# Altium project A540R260_ARM2.PrjPcb
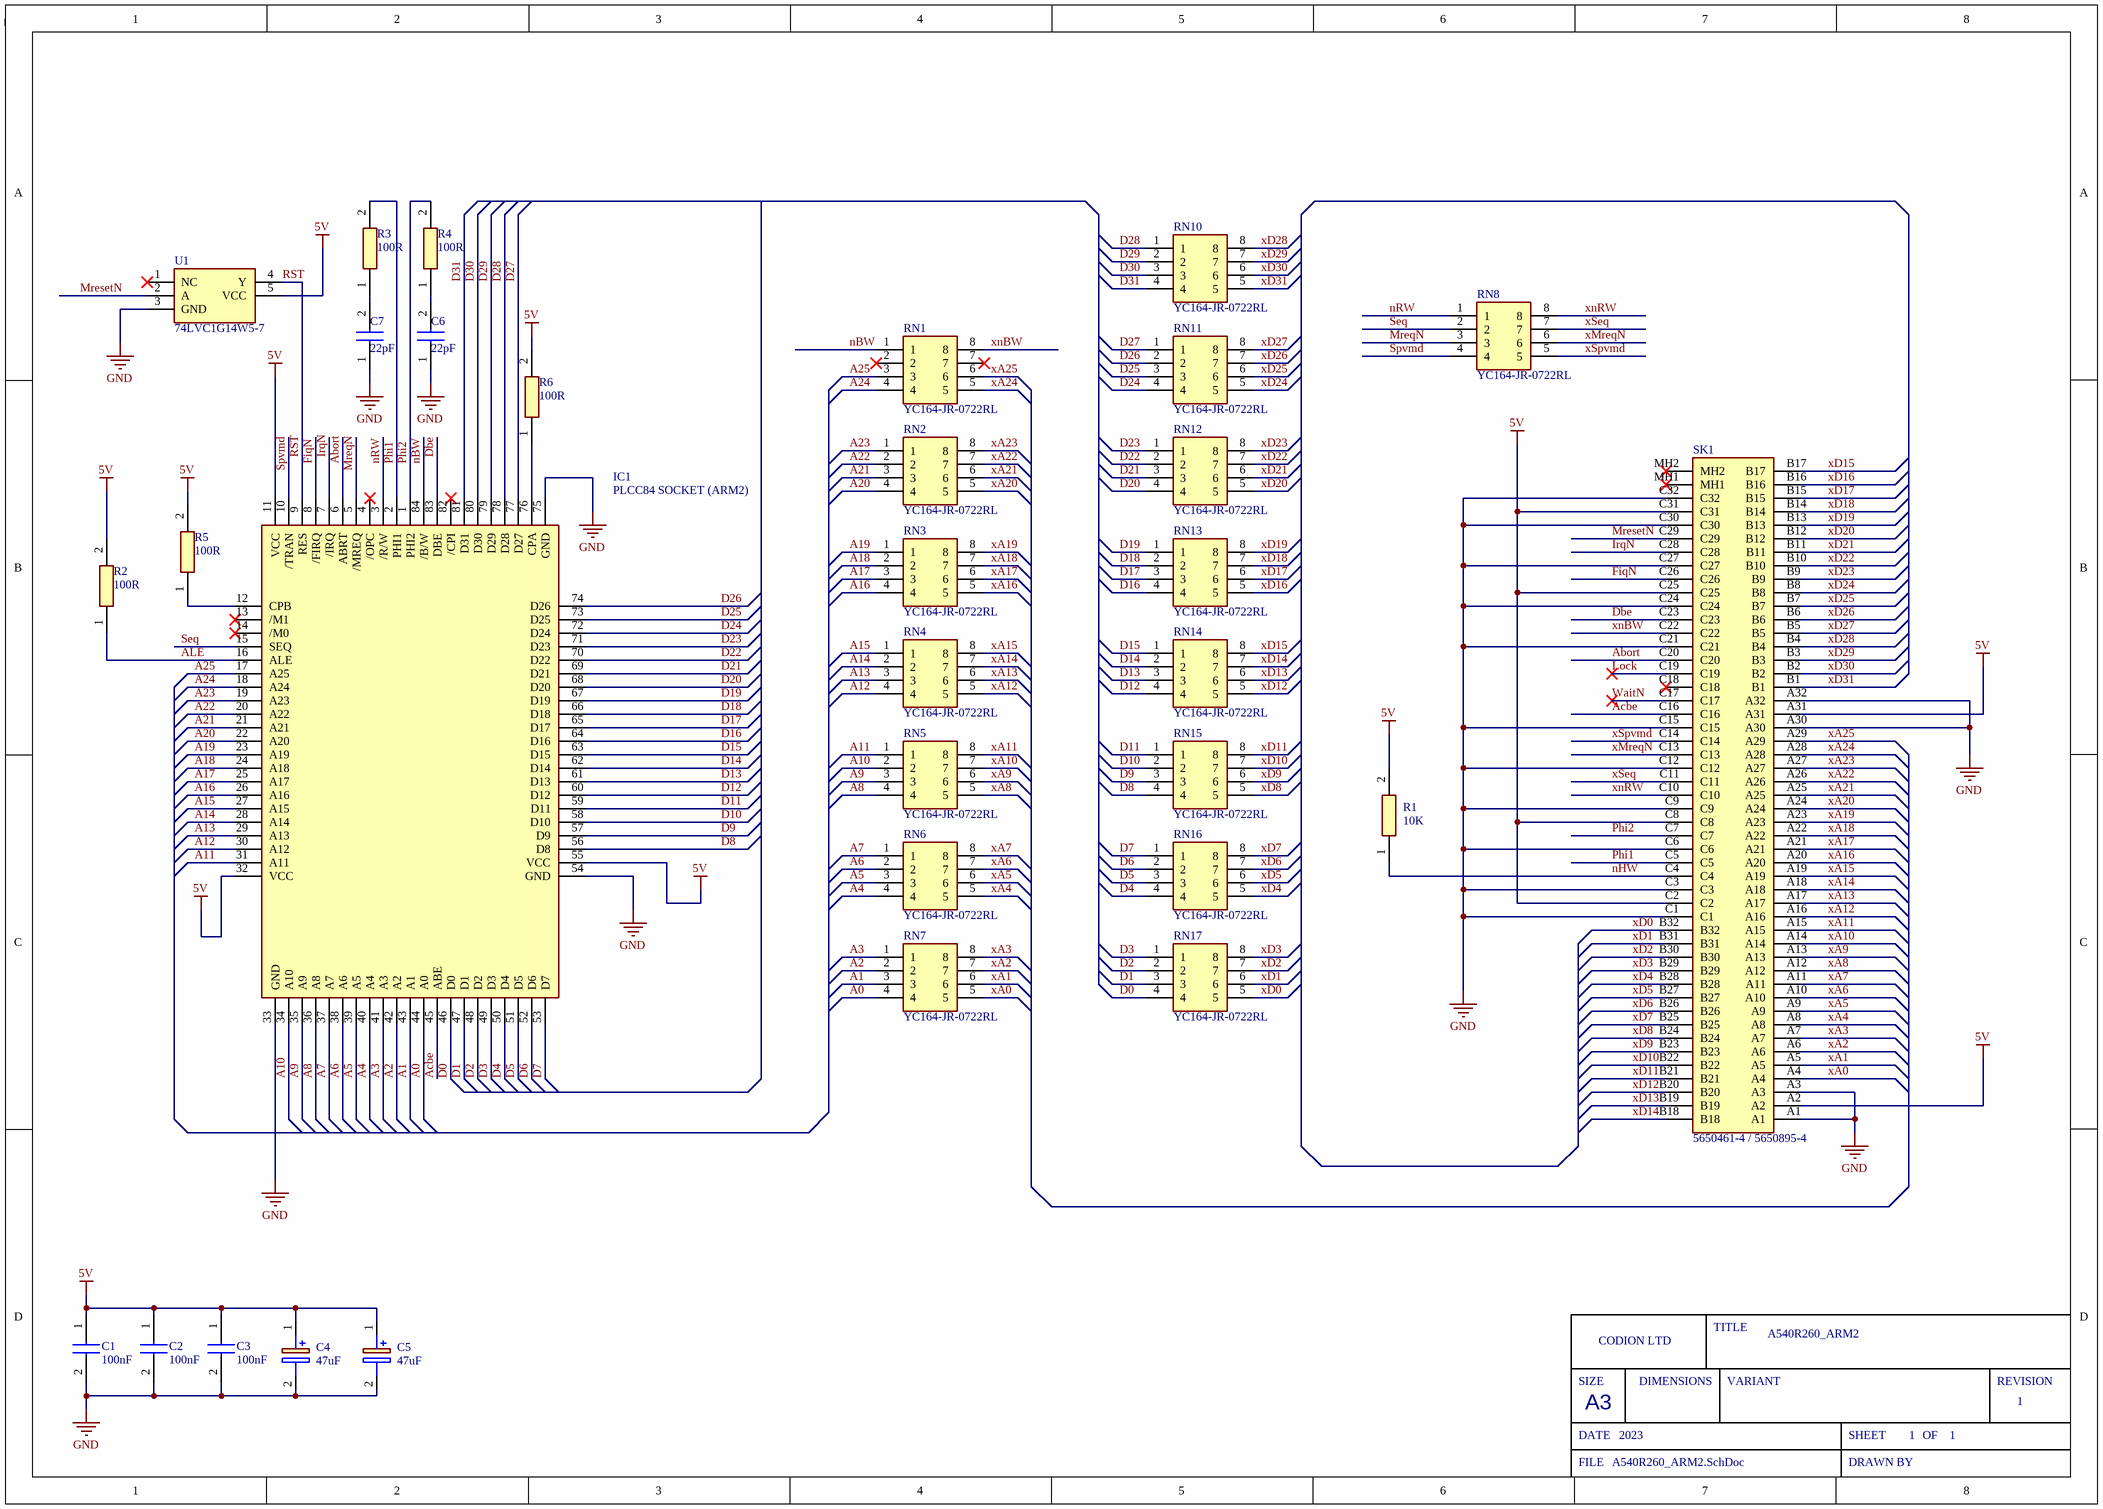
[diagram p0: A540R260_ARM2.SchDoc]
Project_Title: A540R260_ARM2; Sch_ReleaseDate: 2023; Sch_RevNo: 1
1 sheet, 32 parts. Net scope: global (net labels, ports and power ports of the same name join across sheets).
Board file: A540R260_ARM2.PcbDoc

## Sheet A540R260_ARM2.SchDoc
size A3; SheetNumber: 1; SheetTotal: 1

### Parts
C1  100nF  [CAPC2012X145N]
C2  100nF  [CAPC2012X145N]
C3  100nF  [CAPC2012X145N]
C4  47uF  [EEE1AA101SP]
C5  47uF  [EEE1AA101SP]
C6  22pF  [C0805]
C7  22pF  [C0805]
IC1  PLCC84 SOCKET (ARM2)  [PLCC84_PLUG]
R1  10K  [RESC2012X60N]
R2  100R  [RESC2012X60N]
R3  100R  [RESC2012X60N]
R4  100R  [RESC2012X60N]
R5  100R  [RESC2012X60N]
R6  100R  [RESC2012X60N]
RN1  YC164-JR-0722RL  [YC164JR072K2L]
RN2  YC164-JR-0722RL  [YC164JR072K2L]
RN3  YC164-JR-0722RL  [YC164JR072K2L]
RN4  YC164-JR-0722RL  [YC164JR072K2L]
RN5  YC164-JR-0722RL  [YC164JR072K2L]
RN6  YC164-JR-0722RL  [YC164JR072K2L]
RN7  YC164-JR-0722RL  [YC164JR072K2L]
RN8  YC164-JR-0722RL  [YC164JR072K2L]
RN10  YC164-JR-0722RL  [YC164JR072K2L]
RN11  YC164-JR-0722RL  [YC164JR072K2L]
RN12  YC164-JR-0722RL  [YC164JR072K2L]
RN13  YC164-JR-0722RL  [YC164JR072K2L]
RN14  YC164-JR-0722RL  [YC164JR072K2L]
RN15  YC164-JR-0722RL  [YC164JR072K2L]
RN16  YC164-JR-0722RL  [YC164JR072K2L]
RN17  YC164-JR-0722RL  [YC164JR072K2L]
SK1  5650461-4 / 5650895-4  [56504614]
U1  74LVC1G14W5-7  [SOT95P285X140-5N]

### Nets
5V: C1.1 C2.1 C3.1 C4.1(+) C5.1(+) IC1.11(VCC) IC1.32(VCC) IC1.55(VCC) R1.2 R2.2 R5.2 R6.2 SK1.A2 SK1.A31 SK1.C2 SK1.C8 SK1.C25 SK1.C31 U1.5(VCC)
GND: C1.2 C2.2 C3.2 C4.2(-) C5.2(-) C6.1 C7.1 IC1.33(GND) IC1.54(GND) IC1.75(GND) SK1.A1 SK1.A3 SK1.A30 SK1.A32 SK1.C1 SK1.C3 SK1.C6 SK1.C9 SK1.C12 SK1.C15 SK1.C21 SK1.C24 SK1.C27 SK1.C30 SK1.C32 U1.3(GND)
A0: IC1.44(A0) RN7.4
A1: IC1.43(A1) RN7.3
A2: IC1.42(A2) RN7.2
A3: IC1.41(A3) RN7.1
A4: IC1.40(A4) RN6.4
A5: IC1.39(A5) RN6.3
A6: IC1.38(A6) RN6.2
A7: IC1.37(A7) RN6.1
A8: IC1.36(A8) RN5.4
A9: IC1.35(A9) RN5.3
A10: IC1.34(A10) RN5.2
A11: IC1.31(A11) RN5.1
A12: IC1.30(A12) RN4.4
A13: IC1.29(A13) RN4.3
A14: IC1.28(A14) RN4.2
A15: IC1.27(A15) RN4.1
A16: IC1.26(A16) RN3.4
A17: IC1.25(A17) RN3.3
A18: IC1.24(A18) RN3.2
A19: IC1.23(A19) RN3.1
A20: IC1.22(A20) RN2.4
A21: IC1.21(A21) RN2.3
A22: IC1.20(A22) RN2.2
A23: IC1.19(A23) RN2.1
A24: IC1.18(A24) RN1.4
A25: IC1.17(A25) RN1.3
Abort: IC1.6(ABRT) SK1.C20
Acbe: IC1.45(ABE) SK1.C16
ALE: IC1.16(ALE) R2.1
D0: IC1.46(D0) RN17.4
D1: IC1.47(D1) RN17.3
D2: IC1.48(D2) RN17.2
D3: IC1.49(D3) RN17.1
D4: IC1.50(D4) RN16.4
D5: IC1.51(D5) RN16.3
D6: IC1.52(D6) RN16.2
D7: IC1.53(D7) RN16.1
D8: IC1.56(D8) RN15.4
D9: IC1.57(D9) RN15.3
D10: IC1.58(D10) RN15.2
D11: IC1.59(D11) RN15.1
D12: IC1.60(D12) RN14.4
D13: IC1.61(D13) RN14.3
D14: IC1.62(D14) RN14.2
D15: IC1.63(D15) RN14.1
D16: IC1.64(D16) RN13.4
D17: IC1.65(D17) RN13.3
D18: IC1.66(D18) RN13.2
D19: IC1.67(D19) RN13.1
D20: IC1.68(D20) RN12.4
D21: IC1.69(D21) RN12.3
D22: IC1.70(D22) RN12.2
D23: IC1.71(D23) RN12.1
D24: IC1.72(D24) RN11.4
D25: IC1.73(D25) RN11.3
D26: IC1.74(D26) RN11.2
D27: IC1.77(D27) RN11.1
D28: IC1.78(D28) RN10.1
D29: IC1.79(D29) RN10.2
D30: IC1.80(D30) RN10.3
D31: IC1.81(D31) RN10.4
Dbe: IC1.83(DBE) SK1.C23
FiqN: IC1.8(/FIRQ) SK1.C26
IrqN: IC1.7(/IRQ) SK1.C28
Lock: SK1.C19
MreqN: IC1.5(/MREQ) RN8.3
MresetN: SK1.C29 U1.2(A)
nBW: IC1.84(/B/W) RN1.1
nHW: R1.1 SK1.C4
nRW: IC1.3(/R/W) RN8.1
Phi1: IC1.2(PHI1) R3.2 SK1.C5
Phi2: IC1.1(PHI2) R4.2 SK1.C7
RST: IC1.9(RES) U1.4(Y)
Seq: IC1.15(SEQ) RN8.2
Spvmd: IC1.10(/TRAN) RN8.4
WaitN: SK1.C17
xA0: RN7.5 SK1.A4
xA1: RN7.6 SK1.A5
xA2: RN7.7 SK1.A6
xA3: RN7.8 SK1.A7
xA4: RN6.5 SK1.A8
xA5: RN6.6 SK1.A9
xA6: RN6.7 SK1.A10
xA7: RN6.8 SK1.A11
xA8: RN5.5 SK1.A12
xA9: RN5.6 SK1.A13
xA10: RN5.7 SK1.A14
xA11: RN5.8 SK1.A15
xA12: RN4.5 SK1.A16
xA13: RN4.6 SK1.A17
xA14: RN4.7 SK1.A18
xA15: RN4.8 SK1.A19
xA16: RN3.5 SK1.A20
xA17: RN3.6 SK1.A21
xA18: RN3.7 SK1.A22
xA19: RN3.8 SK1.A23
xA20: RN2.5 SK1.A24
xA21: RN2.6 SK1.A25
xA22: RN2.7 SK1.A26
xA23: RN2.8 SK1.A27
xA24: RN1.5 SK1.A28
xA25: RN1.6 SK1.A29
xD0: RN17.5 SK1.B32
xD1: RN17.6 SK1.B31
xD2: RN17.7 SK1.B30
xD3: RN17.8 SK1.B29
xD4: RN16.5 SK1.B28
xD5: RN16.6 SK1.B27
xD6: RN16.7 SK1.B26
xD7: RN16.8 SK1.B25
xD8: RN15.5 SK1.B24
xD9: RN15.6 SK1.B23
xD10: RN15.7 SK1.B22
xD11: RN15.8 SK1.B21
xD12: RN14.5 SK1.B20
xD13: RN14.6 SK1.B19
xD14: RN14.7 SK1.B18
xD15: RN14.8 SK1.B17
xD16: RN13.5 SK1.B16
xD17: RN13.6 SK1.B15
xD18: RN13.7 SK1.B14
xD19: RN13.8 SK1.B13
xD20: RN12.5 SK1.B12
xD21: RN12.6 SK1.B11
xD22: RN12.7 SK1.B10
xD23: RN12.8 SK1.B9
xD24: RN11.5 SK1.B8
xD25: RN11.6 SK1.B7
xD26: RN11.7 SK1.B6
xD27: RN11.8 SK1.B5
xD28: RN10.8 SK1.B4
xD29: RN10.7 SK1.B3
xD30: RN10.6 SK1.B2
xD31: RN10.5 SK1.B1
xMreqN: RN8.6 SK1.C13
xnBW: RN1.8 SK1.C22
xnRW: RN8.8 SK1.C10
xSeq: RN8.7 SK1.C11
xSpvmd: RN8.5 SK1.C14
NetC6_2: C6.2 R4.1
NetC7_2: C7.2 R3.1
NetIC1_12: IC1.12(CPB) R5.1
NetIC1_76: IC1.76(CPA) R6.1

Not connected (* = marked no-connect by the designer): IC1 4(/OPC)* 13(/M1)* 14(/M0)* 82(/CPI)*; RN1 2* 7*; SK1 C18* MH1* MH2*; U1 1(NC)*

### Notes on the sheet
- SIZE
- CODION LTD
- DIMENSIONS
- TITLE
- VARIANT
- REVISION
- DATE
- A3
- SHEET
- OF
- FILE
- DRAWN BY

### Library data of the parts
C1-C3 = C2012X7R1H104K125AM: Capacitor; Manufacturer_Name: TDK; Datasheet Link: https://product.tdk.com/info/en/catalog/datasheets/mlcc_commercial_midvoltage_en.pdf; Height: 1.45mm; Manufacturer_Part_Number: C2012X7R1H104K125AM; Mouser Part Number: 810-C2012X7R1H104KT5; Mouser Price/Stock: https://www.mouser.com/Search/Refine.aspx?Keyword=810-C2012X7R1H104KT5; Arrow Part Number: C2012X7R1H104K125AM; Arrow Price/Stock: https://www.arrow.com/en/products/c2012x7r1h104k125am/tdk
C4 C5 = EEE1VA470WP: Capacitor Polarised; Manufacturer_Name: Panasonic; Datasheet Link: http://industrial.panasonic.com/cdbs/www-data/pdf/RDE0000/ABA0000C1145.pdf; Height: 7.8mm; Manufacturer_Part_Number: EEE1VA470WP
C6 C7 = C0805C220J5GACTU: Capacitor; Manufacturer_Name: KEMET; Datasheet Link: https://content.kemet.com/datasheets/KEM_C1003_C0G_SMD.pdf; Height: 1.1mm; Manufacturer_Part_Number: C0805C220J5GACTU; Mouser Part Number: 80-C0805C220J5G; Mouser Price/Stock: https://www.mouser.co.uk/ProductDetail/KEMET/C0805C220J5GACTU?qs=4DgSOGFclrMUW3bJDWrdLw%3D%3D; Arrow Part Number: C0805C220J5GACTU; Arrow Price/Stock: https://www.arrow.com/en/products/c0805c220j5gactu/kemet-corporation?region=nac
IC1 = PLCC84_PLUG_ARM2: PLCC84 Plug; Manufacturer_Name: Winslow; Manufacturer_Part_Number: W9328; Height: 15mm
R1 = RC0805JR-0710KL: Resistor; Manufacturer_Name: KEMET; Datasheet Link: https://datasheet.datasheetarchive.com/originals/distributors/Datasheets_SAMA/902f9e387b938f871d31120f5fc1d65e.pdf; Height: 0.6mm; Manufacturer_Part_Number: RC0805JR-0710KL; Mouser Part Number: 603-RC0805JR-0710KL; Mouser Price/Stock: https://www.mouser.co.uk/ProductDetail/YAGEO/RC0805JR-0710KL?qs=ZFGQJeMQzF5q%2Fp77vM%2FrVQ%3D%3D; Arrow Part Number: RC0805JR-0710KL; Arrow Price/Stock: https://www.arrow.com/en/products/rc0805jr-0710kl/yageo
R2-R6 = RC0805FR-07100RL: Resistor; Manufacturer_Name: KEMET; Datasheet Link: https://datasheet.datasheetarchive.com/originals/distributors/Datasheets_SAMA/902f9e387b938f871d31120f5fc1d65e.pdf; Height: 0.6mm; Manufacturer_Part_Number: RC0805FR-07100RL; Mouser Part Number: 603-RC0805FR-07100RL; Mouser Price/Stock: https://www.mouser.co.uk/ProductDetail/YAGEO/RC0805FR-07100RL?qs=8Y8p%252BasKcI6MtXUgG4E6SQ%3D%3D; Arrow Part Number: RC0805FR-07100RL; Arrow Price/Stock: https://www.arrow.com/en/products/rc0805fr-07100rl/yageo?region=europe
RN1-RN8 RN10-RN17 = YC164-JR-0722RL: Resistor Network; Manufacturer_Name: KEMET; Datasheet Link: https://componentsearchengine.com/Datasheets/2/YC164-JR-072K2L.pdf; Height: 0.7mm; Manufacturer_Part_Number: YC164-JR-0722RL; Mouser Part Number: 603-YC164-JR-0722RL; Mouser Price/Stock: https://www.mouser.co.uk/ProductDetail/YAGEO/YC164-JR-0722RL?qs=PUN631quMycSauRlrBstDw%3D%3D; Arrow Part Number: YC164-JR-0722RL; Arrow Price/Stock: https://www.arrow.com/en/products/yc164-jr-0722rl/yageo
SK1 = 5650461-4: Connector; Manufacturer_Name: TE Connectivity; Datasheet Link: https://componentsearchengine.com/Datasheets/2/5650461-4.pdf; Height: 10.49mm; Manufacturer_Part_Number: 5650461-4; Mouser Part Number: 571-5650461-4; Mouser Price/Stock: https://www.mouser.co.uk/ProductDetail/TE-Connectivity/5650461-4?qs=xrnNvQC1SKQ%2FjdFwmiH0Uw%3D%3D; Arrow Part Number: 5650461-4; Arrow Price/Stock: https://www.arrow.com/en/products/5650461-4/te-connectivity
U1 = 74LVC1G14W5-7: Undefined or Miscellaneous; Manufacturer_Name: Diodes Inc.; Datasheet Link: https://componentsearchengine.com/Datasheets/2/74LVC1G14W5-7.pdf; Height: 1.4mm; Manufacturer_Part_Number: 74LVC1G14W5-7; Mouser Part Number: 621-74LVC1G14W5-7; Mouser Price/Stock: https://www.mouser.co.uk/ProductDetail/Diodes-Incorporated/74LVC1G14W5-7?qs=FRHfhEBFk1cKmKLlF8IuuQ%3D%3D; Arrow Part Number: 74LVC1G14W5-7; Arrow Price/Stock: https://www.arrow.com/en/products/74lvc1g14w5-7/diodes-incorporated?region=nac